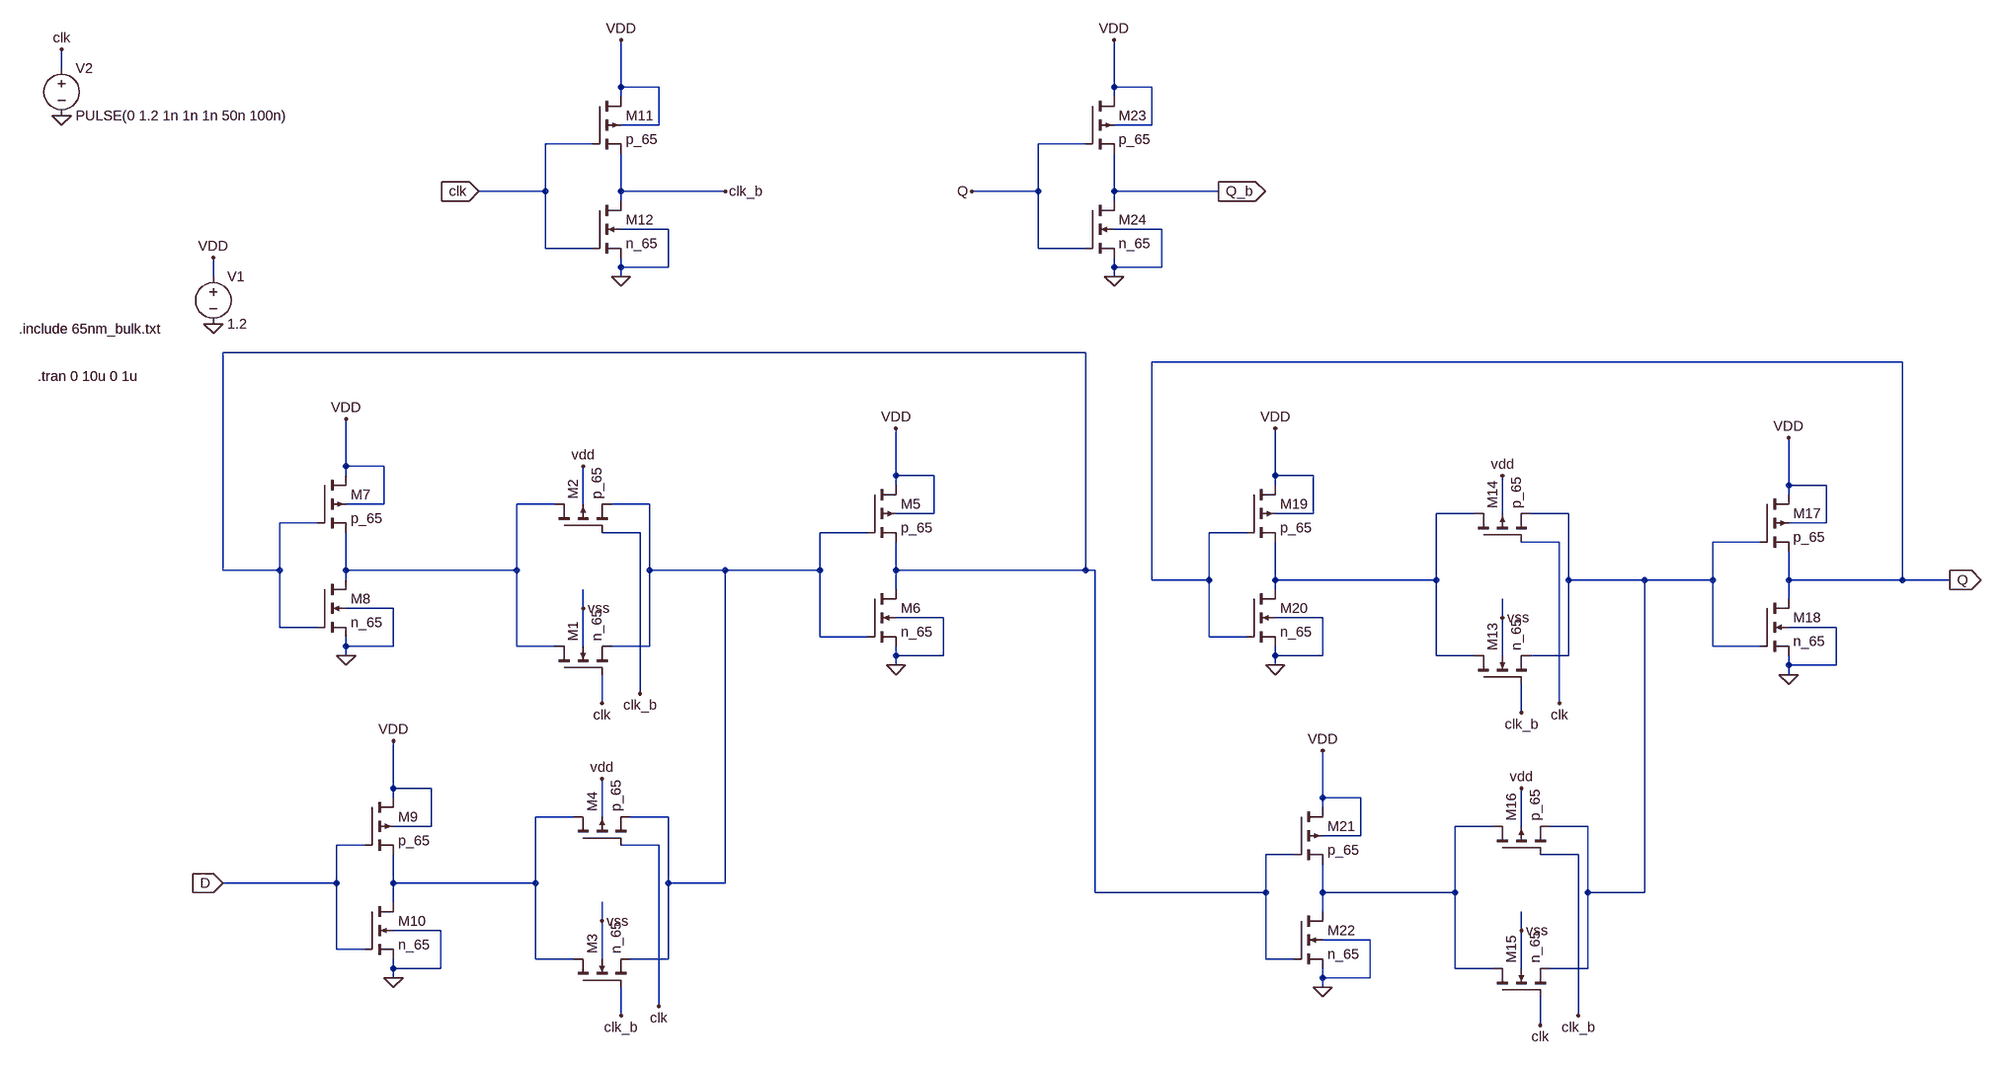
[diagram p0: schematic dflip_flop.asc]
dflip_flop.asc, the LTspice schematic file:
Version 4
SHEET 1 3264 1132
WIRE -176 -576 -176 -608
WIRE 768 -544 768 -624
WIRE 832 -544 768 -544
WIRE 1600 -544 1600 -624
WIRE 1664 -544 1600 -544
WIRE 768 -528 768 -544
WIRE 1600 -528 1600 -544
WIRE 832 -480 832 -544
WIRE 832 -480 768 -480
WIRE 1664 -480 1664 -544
WIRE 1664 -480 1600 -480
WIRE 720 -448 640 -448
WIRE 1552 -448 1472 -448
WIRE 640 -368 640 -448
WIRE 640 -368 528 -368
WIRE 768 -368 768 -432
WIRE 944 -368 768 -368
WIRE 1472 -368 1472 -448
WIRE 1472 -368 1360 -368
WIRE 1600 -368 1600 -432
WIRE 1776 -368 1600 -368
WIRE 768 -352 768 -368
WIRE 1600 -352 1600 -368
WIRE 848 -304 768 -304
WIRE 1680 -304 1600 -304
WIRE 640 -272 640 -368
WIRE 720 -272 640 -272
WIRE 1472 -272 1472 -368
WIRE 1552 -272 1472 -272
WIRE 768 -240 768 -256
WIRE 848 -240 848 -304
WIRE 848 -240 768 -240
WIRE 1600 -240 1600 -256
WIRE 1680 -240 1680 -304
WIRE 1680 -240 1600 -240
WIRE 80 -224 80 -256
WIRE 768 -224 768 -240
WIRE 1600 -224 1600 -240
WIRE 1552 -96 96 -96
WIRE 3120 -80 1664 -80
WIRE 304 96 304 16
WIRE 368 96 304 96
WIRE 304 112 304 96
WIRE 1232 112 1232 32
WIRE 1296 112 1232 112
WIRE 1872 112 1872 32
WIRE 1936 112 1872 112
WIRE 1232 128 1232 112
WIRE 1872 128 1872 112
WIRE 2800 128 2800 48
WIRE 2864 128 2800 128
WIRE 2800 144 2800 128
WIRE 368 160 368 96
WIRE 368 160 304 160
WIRE 656 160 592 160
WIRE 704 160 704 96
WIRE 816 160 752 160
WIRE 1296 176 1296 112
WIRE 1296 176 1232 176
WIRE 1936 176 1936 112
WIRE 1936 176 1872 176
WIRE 2224 176 2160 176
WIRE 2272 176 2272 112
WIRE 2384 176 2320 176
WIRE 256 192 192 192
WIRE 2864 192 2864 128
WIRE 2864 192 2800 192
WIRE 800 208 736 208
WIRE 1184 208 1104 208
WIRE 1824 208 1760 208
WIRE 2368 224 2304 224
WIRE 2752 224 2672 224
WIRE 96 272 96 -96
WIRE 192 272 192 192
WIRE 192 272 96 272
WIRE 304 272 304 208
WIRE 592 272 592 160
WIRE 592 272 304 272
WIRE 816 272 816 160
WIRE 944 272 816 272
WIRE 1104 272 1104 208
WIRE 1104 272 944 272
WIRE 1232 272 1232 224
WIRE 1552 272 1552 -96
WIRE 1552 272 1232 272
WIRE 1568 272 1552 272
WIRE 304 288 304 272
WIRE 1664 288 1664 -80
WIRE 1760 288 1760 208
WIRE 1760 288 1664 288
WIRE 1872 288 1872 224
WIRE 2160 288 2160 176
WIRE 2160 288 1872 288
WIRE 2384 288 2384 176
WIRE 2512 288 2384 288
WIRE 2672 288 2672 224
WIRE 2672 288 2512 288
WIRE 2800 288 2800 240
WIRE 3120 288 3120 -80
WIRE 3120 288 2800 288
WIRE 3200 288 3120 288
WIRE 1232 304 1232 272
WIRE 1872 304 1872 288
WIRE 2800 320 2800 288
WIRE 384 336 304 336
WIRE 704 336 704 304
WIRE 1312 352 1232 352
WIRE 1952 352 1872 352
WIRE 2272 352 2272 320
WIRE 192 368 192 272
WIRE 256 368 192 368
WIRE 2880 368 2800 368
WIRE 1104 384 1104 272
WIRE 1184 384 1104 384
WIRE 1760 384 1760 288
WIRE 1824 384 1760 384
WIRE 304 400 304 384
WIRE 384 400 384 336
WIRE 384 400 304 400
WIRE 592 400 592 272
WIRE 656 400 592 400
WIRE 704 400 704 336
WIRE 816 400 816 272
WIRE 816 400 752 400
WIRE 2672 400 2672 288
WIRE 2752 400 2672 400
WIRE 304 416 304 400
WIRE 1232 416 1232 400
WIRE 1312 416 1312 352
WIRE 1312 416 1232 416
WIRE 1872 416 1872 400
WIRE 1952 416 1952 352
WIRE 1952 416 1872 416
WIRE 2160 416 2160 288
WIRE 2224 416 2160 416
WIRE 2272 416 2272 352
WIRE 2384 416 2384 288
WIRE 2384 416 2320 416
WIRE 1232 432 1232 416
WIRE 1872 432 1872 416
WIRE 2800 432 2800 416
WIRE 2880 432 2880 368
WIRE 2880 432 2800 432
WIRE 2800 448 2800 432
WIRE 800 480 800 208
WIRE 736 496 736 448
WIRE 2368 496 2368 224
WIRE 2304 512 2304 464
WIRE 384 640 384 560
WIRE 448 640 384 640
WIRE 384 656 384 640
WIRE 1952 656 1952 576
WIRE 2016 656 1952 656
WIRE 1952 672 1952 656
WIRE 688 688 624 688
WIRE 736 688 736 624
WIRE 848 688 784 688
WIRE 448 704 448 640
WIRE 448 704 384 704
WIRE 2256 704 2192 704
WIRE 2304 704 2304 640
WIRE 2416 704 2352 704
WIRE 2016 720 2016 656
WIRE 2016 720 1952 720
WIRE 336 736 288 736
WIRE 832 736 768 736
WIRE 1904 752 1856 752
WIRE 2400 752 2336 752
WIRE 288 800 288 736
WIRE 288 800 96 800
WIRE 384 800 384 752
WIRE 624 800 624 688
WIRE 624 800 384 800
WIRE 848 800 848 688
WIRE 944 800 944 272
WIRE 944 800 848 800
WIRE 1568 816 1568 272
WIRE 1856 816 1856 752
WIRE 1856 816 1568 816
WIRE 1952 816 1952 768
WIRE 2192 816 2192 704
WIRE 2192 816 1952 816
WIRE 2416 816 2416 704
WIRE 2512 816 2512 288
WIRE 2512 816 2416 816
WIRE 384 832 384 800
WIRE 1952 848 1952 816
WIRE 736 864 736 832
WIRE 464 880 384 880
WIRE 2304 880 2304 848
WIRE 2032 896 1952 896
WIRE 288 912 288 800
WIRE 336 912 288 912
WIRE 624 928 624 800
WIRE 688 928 624 928
WIRE 736 928 736 864
WIRE 848 928 848 800
WIRE 848 928 784 928
WIRE 1856 928 1856 816
WIRE 1904 928 1856 928
WIRE 384 944 384 928
WIRE 464 944 464 880
WIRE 464 944 384 944
WIRE 2192 944 2192 816
WIRE 2256 944 2192 944
WIRE 2304 944 2304 880
WIRE 2416 944 2416 816
WIRE 2416 944 2352 944
WIRE 384 960 384 944
WIRE 1952 960 1952 944
WIRE 2032 960 2032 896
WIRE 2032 960 1952 960
WIRE 1952 976 1952 960
WIRE 832 1008 832 736
WIRE 768 1024 768 976
WIRE 2400 1024 2400 752
WIRE 2336 1040 2336 992
FLAG 704 336 vss
FLAG 704 96 vdd
FLAG 736 864 vss
FLAG 736 624 vdd
FLAG 1232 432 0
FLAG 1232 32 VDD
FLAG 304 416 0
FLAG 304 16 VDD
FLAG 384 960 0
FLAG 384 560 VDD
FLAG 96 800 D
IOPIN 96 800 In
FLAG 80 -144 0
FLAG 80 -256 VDD
FLAG -176 -496 0
FLAG -176 -608 clk
FLAG 768 -224 0
FLAG 768 -624 VDD
FLAG 944 -368 clk_b
FLAG 528 -368 clk
IOPIN 528 -368 In
FLAG 832 1008 clk
FLAG 736 496 clk
FLAG 800 480 clk_b
FLAG 768 1024 clk_b
FLAG 2272 352 vss
FLAG 2272 112 vdd
FLAG 2304 880 vss
FLAG 2304 640 vdd
FLAG 2800 448 0
FLAG 2800 48 VDD
FLAG 1872 432 0
FLAG 1872 32 VDD
FLAG 1952 976 0
FLAG 1952 576 VDD
FLAG 2400 1024 clk_b
FLAG 2304 512 clk_b
FLAG 2368 496 clk
FLAG 2336 1040 clk
FLAG 1600 -224 0
FLAG 1600 -624 VDD
FLAG 1776 -368 Q_b
IOPIN 1776 -368 Out
FLAG 1360 -368 Q
FLAG 3200 288 Q
IOPIN 3200 288 Out
SYMBOL nmos4 656 448 R270
SYMATTR InstName M1
SYMATTR Value n_65
SYMATTR Value2 l=1u w=1u
SYMBOL pmos4 656 208 R270
SYMATTR InstName M2
SYMATTR Value p_65
SYMATTR Value2 l=1u w=2u
SYMBOL nmos4 688 976 R270
SYMATTR InstName M3
SYMATTR Value n_65
SYMATTR Value2 l=1u w=1u
SYMBOL pmos4 688 736 R270
SYMATTR InstName M4
SYMATTR Value p_65
SYMATTR Value2 l=1u w=2u
SYMBOL pmos4 1184 128 R0
SYMATTR InstName M5
SYMATTR Value2 l=65n w=40u
SYMATTR Value p_65
SYMBOL nmos4 1184 304 R0
SYMATTR InstName M6
SYMATTR Value2 l=65n w=20u
SYMATTR Value n_65
SYMBOL pmos4 256 112 R0
SYMATTR InstName M7
SYMATTR Value2 l=65n w=40u
SYMATTR Value p_65
SYMBOL nmos4 256 288 R0
SYMATTR InstName M8
SYMATTR Value2 l=65n w=20u
SYMATTR Value n_65
SYMBOL pmos4 336 656 R0
SYMATTR InstName M9
SYMATTR Value2 l=65n w=40u
SYMATTR Value p_65
SYMBOL nmos4 336 832 R0
SYMATTR InstName M10
SYMATTR Value2 l=65n w=20u
SYMATTR Value n_65
SYMBOL Voltage 80 -240 R0
SYMATTR InstName V1
SYMATTR Value 1.2
SYMBOL Voltage -176 -592 R0
SYMATTR InstName V2
SYMATTR Value PULSE(0 1.2 1n 1n 1n 50n 100n)
SYMBOL pmos4 720 -528 R0
SYMATTR InstName M11
SYMATTR Value2 l=65n w=40u
SYMATTR Value p_65
SYMBOL nmos4 720 -352 R0
SYMATTR InstName M12
SYMATTR Value2 l=65n w=20u
SYMATTR Value n_65
SYMBOL nmos4 2224 464 R270
SYMATTR InstName M13
SYMATTR Value n_65
SYMATTR Value2 l=1u w=1u
SYMBOL pmos4 2224 224 R270
SYMATTR InstName M14
SYMATTR Value p_65
SYMATTR Value2 l=1u w=2u
SYMBOL nmos4 2256 992 R270
SYMATTR InstName M15
SYMATTR Value n_65
SYMATTR Value2 l=1u w=1u
SYMBOL pmos4 2256 752 R270
SYMATTR InstName M16
SYMATTR Value p_65
SYMATTR Value2 l=1u w=2u
SYMBOL pmos4 2752 144 R0
SYMATTR InstName M17
SYMATTR Value2 l=65n w=40u
SYMATTR Value p_65
SYMBOL nmos4 2752 320 R0
SYMATTR InstName M18
SYMATTR Value2 l=65n w=20u
SYMATTR Value n_65
SYMBOL pmos4 1824 128 R0
SYMATTR InstName M19
SYMATTR Value2 l=65n w=40u
SYMATTR Value p_65
SYMBOL nmos4 1824 304 R0
SYMATTR InstName M20
SYMATTR Value2 l=65n w=20u
SYMATTR Value n_65
SYMBOL pmos4 1904 672 R0
SYMATTR InstName M21
SYMATTR Value2 l=65n w=40u
SYMATTR Value p_65
SYMBOL nmos4 1904 848 R0
SYMATTR InstName M22
SYMATTR Value2 l=65n w=20u
SYMATTR Value n_65
SYMBOL pmos4 1552 -528 R0
SYMATTR InstName M23
SYMATTR Value2 l=65n w=40u
SYMATTR Value p_65
SYMBOL nmos4 1552 -352 R0
SYMATTR InstName M24
SYMATTR Value2 l=65n w=20u
SYMATTR Value n_65
TEXT -248 -136 Left 2 !.include 65nm_bulk.txt
TEXT -216 -56 Left 2 !.tran 0 10u 0 1u

The netlist it stands for:
* dflip_flop.asc
M1 N002 clk N003 vss n_65 l=1u w=1u
M2 N002 clk_b N003 vdd p_65 l=1u w=2u
M3 N006 clk_b N003 vss n_65 l=1u w=1u
M4 N006 clk N003 vdd p_65 l=1u w=2u
M5 vdd N003 N001 vdd p_65 l=65n w=40u
M6 N001 N003 0 0 n_65 l=65n w=20u
M7 vdd N001 N002 vdd p_65 l=65n w=40u
M8 N002 N001 0 0 n_65 l=65n w=20u
M9 vdd D N006 vdd p_65 l=65n w=40u
M10 N006 D 0 0 n_65 l=65n w=20u
V1 vdd 0 1.2
V2 clk 0 PULSE(0 1.2 1n 1n 1n 50n 100n)
M11 vdd clk clk_b vdd p_65 l=65n w=40u
M12 clk_b clk 0 0 n_65 l=65n w=20u
M13 N004 clk_b N005 vss n_65 l=1u w=1u
M14 N004 clk N005 vdd p_65 l=1u w=2u
M15 N007 clk N005 vss n_65 l=1u w=1u
M16 N007 clk_b N005 vdd p_65 l=1u w=2u
M17 vdd N005 Q vdd p_65 l=65n w=40u
M18 Q N005 0 0 n_65 l=65n w=20u
M19 vdd Q N004 vdd p_65 l=65n w=40u
M20 N004 Q 0 0 n_65 l=65n w=20u
M21 vdd N001 N007 vdd p_65 l=65n w=40u
M22 N007 N001 0 0 n_65 l=65n w=20u
M23 vdd Q Q_b vdd p_65 l=65n w=40u
M24 Q_b Q 0 0 n_65 l=65n w=20u
.model NMOS NMOS
.model PMOS PMOS
.lib standard.mos
.include 65nm_bulk.txt
.tran 0 10u 0 1u
.backanno
.end